# EAGLE design fabisp (EAGLE 5.11)
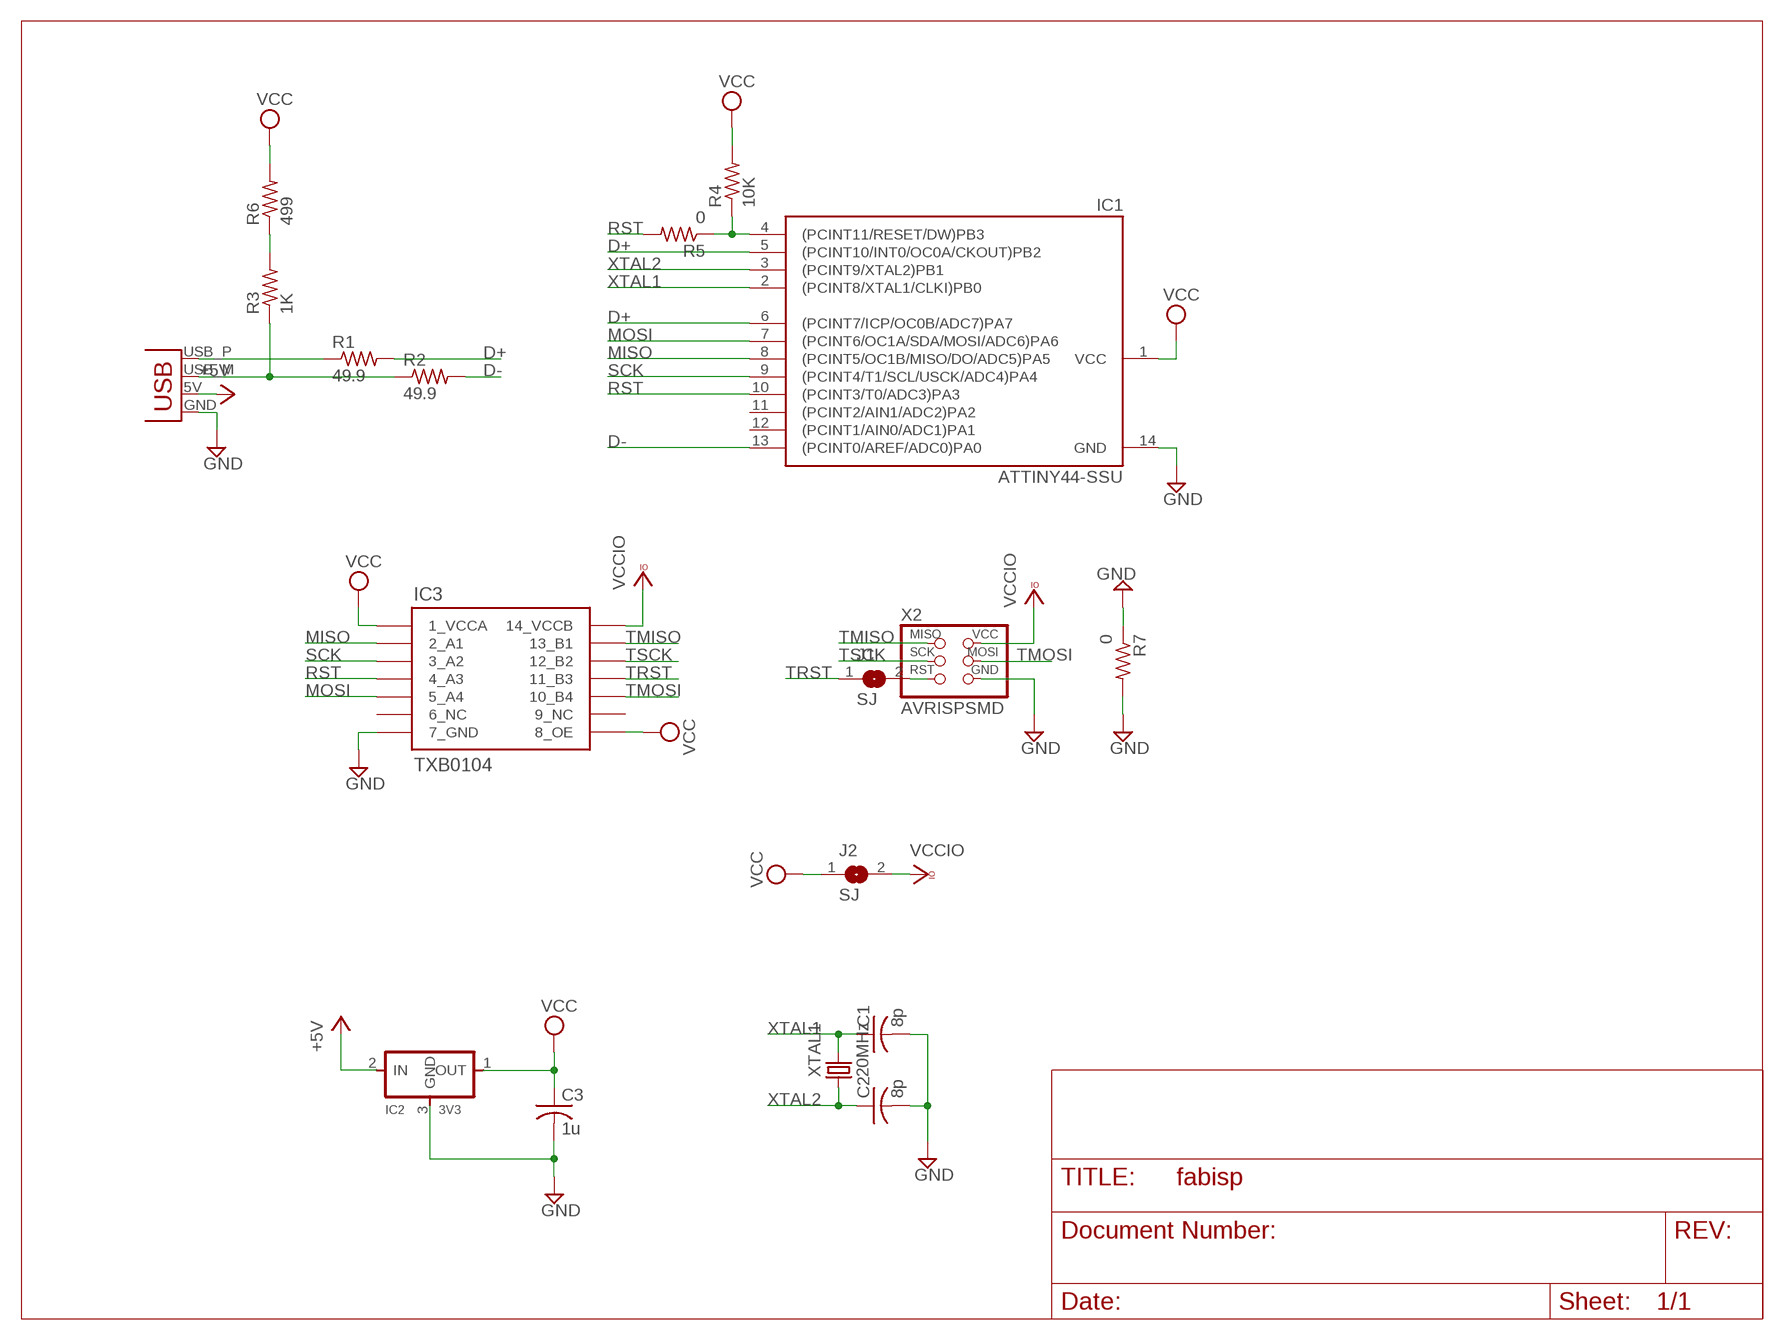
[diagram p0: schematic, sheet 1]

## Parts
C1  8p  C-USC1206  [C1206]
C2  8p  C-USC1206  [C1206]
C3  1u  C-USC1206  [C1206]
IC1  ATTINY44-SSU  [SOIC14]
IC2  3V3  REGULATORSOT23  [SOT23]
IC3  TXB0104  [SO14]
J1  SJ  SOLDER_JUMPER  [SJFAB]
J2  SJ  SOLDER_JUMPER  [SJFAB]
R1  49.9  R-US_R1206  [R1206]
R2  49.9  R-US_R1206  [R1206]
R3  1K  R-US_R1206  [R1206]
R4  10K  R-US_R1206  [R1206]
R5  0  R-US_R1206  [R1206]
R6  499  R-US_R1206  [R1206]
R7  0  R-US_R1206  [R1206]
X1  USBPCB  [USB-A-PCB]
X2  AVRISPSMD  [2X03SMD]
XTAL1  20MHz  CRYSTAL  [2-SMD-5X3MM]

## Nets
+5V: IC2.2(IN) X1.5V(VBUS)
D+: IC1.5((PCINT10/INT0/OC0A/CKOUT)PB2) IC1.6((PCINT7/ICP/OC0B/ADC7)PA7) R1.2
D-: IC1.13((PCINT0/AREF/ADC0)PA0) R2.2
GND: C1.2 C2.2 C3.2 IC1.14(GND) IC2.3(GND) IC3.7(7_GND) R7.1 R7.2 X1.GND X2.6(GND)
MISO: IC1.8((PCINT5/OC1B/MISO/DO/ADC5)PA5) IC3.2(2_A1)
MOSI: IC1.7((PCINT6/OC1A/SDA/MOSI/ADC6)PA6) IC3.5(5_A4)
N$1: R1.1 X1.USB_P(D+)
N$2: R2.1 R3.1 X1.USB_M(D-)
N$3: J1.2 X2.5(RST)
N$4: IC1.4((PCINT11/RESET/DW)PB3) R4.1 R5.1
N$6: R3.2 R6.1
RST: IC1.10((PCINT3/T0/ADC3)PA3) IC3.4(4_A3) R5.2
SCK: IC1.9((PCINT4/T1/SCL/USCK/ADC4)PA4) IC3.3(3_A2)
TMISO: IC3.13(13_B1) X2.1(MISO)
TMOSI: IC3.10(10_B4) X2.4(MOSI)
TRST: IC3.11(11_B3) J1.1
TSCK: IC3.12(12_B2) X2.3(SCK)
VCC: C3.1 IC1.1(VCC) IC2.1(OUT) IC3.1(1_VCCA) IC3.8(8_OE) J2.1 R4.2 R6.2
VCCIO: IC3.14(14_VCCB) J2.2 X2.2(VCC)
XTAL1: C1.1 IC1.2((PCINT8/XTAL1/CLKI)PB0) XTAL1.P$2
XTAL2: C2.1 IC1.3((PCINT9/XTAL2)PB1) XTAL1.P$1
Unconnected: IC1.11((PCINT2/AIN1/ADC2)PA2) IC1.12((PCINT1/AIN0/ADC1)PA1) IC3.6(6_NC) IC3.9(9_NC)

## Library data of the parts
C1-C3 = rcl:C-US: CAPACITOR, American symbol
IC1 = fab:ATTINY44
IC2 = fab:REGULATOR
IC3 = ti:TXB0104
J1 J2 = fab:SOLDER_JUMPER
R1-R7 = rcl:R-US_: RESISTOR, American symbol
X1 = SparkFun:USB: USB Connectors USB-B-PTH is fully proven SKU : PRT-00139 USB-miniB is fully proven SKU : PRT-00587 USB-A-PCB is untested. USB-A-H is throughly reviewed, but untested. Spark Fun Electronics SKU : PRT-00437 USB-B-SMT is throughly reviewed, but untested. Needs silkscreen touching up. USB-A-S has not been used/tested USB-MB-H has not been used/tested
X2 = fab:AVRISP
XTAL1 = fab:CRYSTAL

## Board
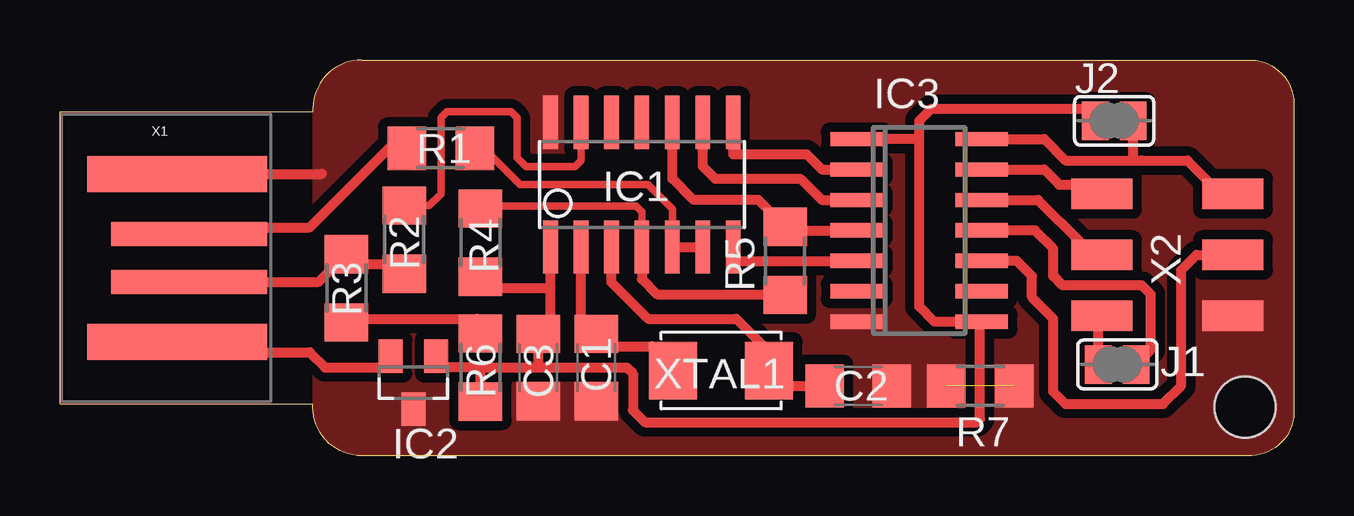
[diagram p1: board, top side]

Size 51.44 x 16.51 mm. Coordinates in mm from the lower left corner, seen from the top.
Outline: 0,2.16 10.54,2.16 10.54,2.03 arc90 12.57,0 49.53,0 arc90 51.44,1.78 51.44,14.73 arc90 49.53,16.51 12.57,16.51 arc90 10.54,14.48 10.54,14.35 0,14.35 0,2.16
Copper layers (1*16): Top 0.035mm / dielectric 1.5mm / Bottom 0.035mm
Design rules "fab": minimum track width 12mil, minimum drill 0.8mm, track to track 15.5mil, track to pad 15.5mil, pad to pad 15mil, via to via 15mil, smd to smd 10mil, copper to edge 0mil, drill to drill 1mm, minimum pad ring 0.2mm, minimum via ring 0.2mm, stop-mask expansion 4mil, vias tented up to drill 0mil, thermal gap 1mm
Holes 2.54 mm at 49.4,2.03
tRestrict: 4 lines

### Footprints (pad centres in the part's own frame; a part is rotated, then mirrored left to right if it is on the bottom)
C1206 = smd 1.6 x 1.8: 1 -1.4,0; 2 1.4,0
SOIC14 = smd 0.61 x 2.21: 1 -3.81,-2.603; 2 -2.54,-2.603; 3 -1.27,-2.603; 4 0,-2.603; 5 1.27,-2.603; 6 2.54,-2.603; 7 3.81,-2.603; 8 3.81,2.603; 9 2.54,2.603; 10 1.27,2.603; 11 0,2.603; 12 -1.27,2.603; 13 -2.54,2.603; 14 -3.81,2.603
SOT23 = smd 1 x 1.4: 1 -0.95,-1.1; 2 0.95,-1.1; 3 0,1.1
SO14 = smd 0.6 x 2.2: 1 -3.81,-2.6; 2 -2.54,-2.6; 3 -1.27,-2.6; 4 0,-2.6; 5 1.27,-2.6; 6 2.54,-2.6; 7 3.81,-2.6; 8 3.81,2.6; 9 2.54,2.6; 10 1.27,2.6; 11 0,2.6; 12 -1.27,2.6; 13 -2.54,2.6; 14 -3.81,2.6
SJFAB = smd 1.118 x 1.6: 1 -0.787,0; 2 0.787,0
R1206 = smd 1.6 x 1.803: 1 -1.422,0; 2 1.422,0
USB-A-PCB = smd 7.5 x 1.5: 5V -0.2,-3.5; GND -0.2,3.5 | smd 6.5 x 1: USB_M 0.3,-1; USB_P 0.3,1
2X03SMD = smd 2.54 x 1.27: 1 -2.54,2.54; 2 2.92,2.54; 3 -2.54,0; 4 2.92,0; 5 -2.54,-2.54; 6 2.92,-2.54
2-SMD-5X3MM = smd 2 x 2.4: P$1 -2,0; P$2 2,0

### Placement (x,y rotation side)
C1  22.35,3.68 270 top
C2  33.27,2.92 0 top
C3  19.94,3.68 270 top
IC1  24.26,11.3 0 top
IC2  14.73,3.05 180 top
IC3  35.81,9.4 270 top
J1  44.07,3.81 180 top
J2  43.94,13.97 0 top
R1  15.88,12.83 0 top
R2  14.35,9.02 90 top
R3  11.94,6.99 270 top
R4  17.53,8.89 270 top
R5  30.23,8.13 90 top
R6  17.53,3.68 270 top
R7  38.35,2.92 180 top
X1  5.08,8.26 0 top
X2  45.97,8.38 0 top
XTAL1  27.56,3.56 180 top

### Tracks (layer width: path | path; a pad name or v marks a point on that pad's centre or on a via)
+5V
  Top 0.406: IC2.2 13.91,3.88 13.72,3.68 11.05,3.68 10.41,4.32 5.33,4.32 4.9,4.75 X1.5V
D+
  Top 0.305: IC1.5 25.53,10.29 24.51,11.3 19.18,11.3 17.91,12.57 17.55,12.57 R1.2
  Top 0.406: IC1.5 IC1.6
D-
  Top 0.305: IC1.13 21.72,12.32 21.46,12.06 19.43,12.06 19.05,12.45 19.05,14.1 18.8,14.35 16.13,14.35 15.88,14.1 15.88,10.92 15.39,10.44 R2.2
GND  (1 unrouted)
  Top 0.406: X1.GND 10.92,11.76
  pour Top (no thermals): 12.57,16.51 49.53,16.51 arc-90 51.44,14.73 51.44,1.78 arc-90 49.53,0 12.57,0 arc-90 10.54,2.03 10.54,14.48 arc-90
MISO
  Top 0.406: 28.07,14.35 IC1.8 28.07,12.57 31.11,12.57 31.75,11.94 IC3.2
MOSI
  Top 0.406: IC1.7 28.07,8.13 IC3.5
N$1
  Top 0.406: X1.USB_P 5.38,9.53 10.41,9.53 13.72,12.83 R1.1
N$2
  Top 0.305: 14.35,8 R2.1 | 12.32,8 12.32,8.41 R3.1
  Top 0.406: X1.USB_M 10.79,7.25 R3.1 | 12.32,8 14.35,8
N$3
  Top 0.406: J1.2 43.28,5.69 X2.5
N$4
  Top 0.305: IC1.4 24.26,10.16 24,10.41 17.53,10.41 R4.1
  Top 0.406: IC1.4 24.26,7.37 24.89,6.73 30.5,6.73 30.48,6.71 R5.1
N$6
  Top 0.406: R3.2 12.06,5.71 17.4,5.71 17.4,5.11 R6.1
RST
  Top 0.406: IC3.4 29.84,9.4 29.84,9.53 30.23,9.53 R5.2 29.11,10.67 26.42,10.67 25.53,11.56 IC1.10
SCK
  Top 0.406: IC1.9 26.8,12.06 27.3,11.56 30.86,11.56 31.75,10.67 IC3.3
TMISO
  Top 0.406: IC3.13 41.02,11.94 41.66,11.3 43.05,11.3 X2.1
TMOSI
  Top 0.406: IC3.10 39.88,8.13 40.51,7.49 40.51,6.6 41.4,5.71 41.4,2.67 41.91,2.16 45.97,2.16 46.74,2.92 46.74,7.75 47.37,8.38 X2.4
TRST
  Top 0.406: J1.1 45.47,4.42 45.47,6.73 45.09,7.11 41.78,7.11 41.4,7.49 41.4,8.64 40.64,9.4 IC3.11
TSCK
  Top 0.406: X2.3 42.55,8.38 42.55,8.89 40.77,10.67 IC3.12
VCC
  Top 0.406: 19.94,3.68 23.62,3.68 23.88,3.43 23.88,1.91 24.38,1.4 38.23,1.4 38.35,1.52 38.35,5.53 IC3.8 36.45,5.59 35.81,6.22 35.81,13.21 | 19.94,3.68 C3.1 20.45,5.08 20.45,6.99 | 20.45,6.99 IC1.1 | R6.2 17.53,3.68 | 17.53,3.68 19.94,3.68 | 17.53,3.68 15.68,3.68 IC2.1 | R4.2 17.53,6.99 20.45,6.99 | J2.1 43.16,14.48 36.32,14.48 35.81,13.97 35.81,13.21 | 35.81,13.21 IC3.1
VCCIO
  Top 0.406: IC3.14 41.02,13.21 41.91,12.32 44.73,12.32 | X2.2 48.77,11.05 48.26,11.05 46.99,12.32 45.09,12.32 44.73,12.32 | 44.73,12.32 J2.2
XTAL1
  Top 0.406: IC1.2 21.72,5.72 C1.1 22.6,5.08 23.11,4.57 24.67,4.57 XTAL1.P$2
XTAL2
  Top 0.406: IC1.3 22.99,7.24 24.51,5.71 28.19,5.71 29.56,4.35 XTAL1.P$1 | XTAL1.P$1 29.59,3.59 | C2.1 29.56,2.92 XTAL1.P$1